# EAGLE design Smart Extruder Board (EAGLE 7.5.0)
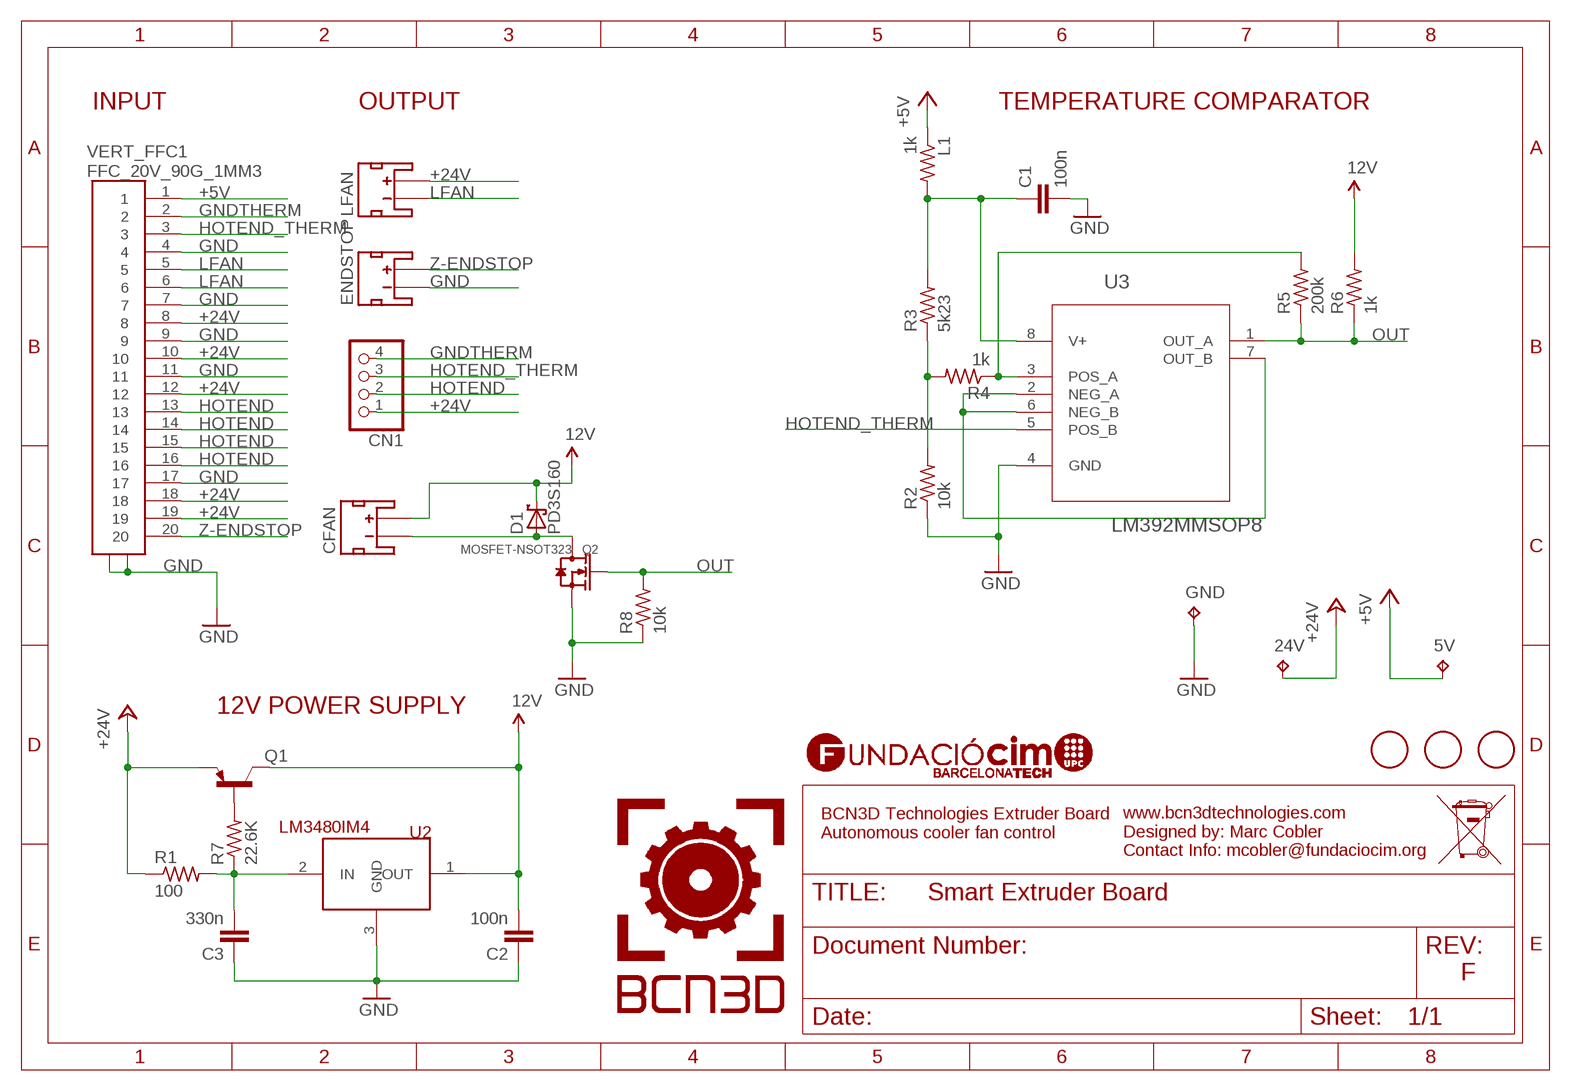
[diagram p0: schematic, sheet 1]

## Parts
5V  TPB1,27  [B1,27]
24V  TPB1,27  [B1,27]
C1  100n  C-EUC0603K  [C0603K]
C2  100n  C-EUC0603K  [C0603K]
C3  330n  C-EUC0805  [C0805]
CFAN  JST_2MM_MALE  [JST-2-SMD]
CN1  JST_4PINPA  [JST_PA_04]
D1  PD3S160  [POWERDI323]
ENDSTOP  JST_2MM_MALE  [JST-2-SMD]
GND  TPB1,27  [B1,27]
L1  1k  R-US_R0603  [R0603]
LFAN  JST_2MM_MALE  [JST-2-SMD]
Q1  BC807W  [SOT323-BEC]
Q2  MOSFET-NSOT323  [SOT323]
R1  100  R-US_R1210  [R1210]
R2  10k  R-US_R0603  [R0603]
R3  5k23  R-US_R0603  [R0603]
R4  1k  R-US_R0603  [R0603]
R5  200k  R-US_R0603  [R0603]
R6  1k  R-US_R0603  [R0603]
R7  22.6K  R-US_R0603  [R0603]
R8  10k  R-US_R0603  [R0603]
U2  LM3480IM4  [SOT23-3]
U3  LM392MMSOP8  [MSOP8]
U$1  FIDUCIAL  [FIDUCIAL_1MM]
U$2  FIDUCIAL  [FIDUCIAL_1MM]
U$3  FIDUCIAL  [FIDUCIAL_1MM]
VERT_FFC1  FFC_20V_90G_1MM3  [FCI_20WAY_1MM_3ST]

## Nets
12V: C2.2 CFAN.2(+) D1.C Q1.3(C) R6.2 U2.1(OUT)
+5V: 5V.TP L1.1 VERT_FFC1.1
+24V: 24V.TP CN1.1 LFAN.2(+) Q1.2(E) R1.1 VERT_FFC1.8 VERT_FFC1.10 VERT_FFC1.12 VERT_FFC1.18 VERT_FFC1.19
DRAIN: CFAN.1(-) D1.A Q2.3(D)
GND: C1.2 C2.1 C3.1 ENDSTOP.1(-) GND.TP Q2.2(S) R2.1 R8.1 U2.3(GND) U3.4(GND) VERT_FFC1.4 VERT_FFC1.7 VERT_FFC1.9 VERT_FFC1.11 VERT_FFC1.17 VERT_FFC1.GND1(GND) VERT_FFC1.GND2(GND)
GNDTHERM: CN1.4 VERT_FFC1.2
HOTEND: CN1.2 VERT_FFC1.13 VERT_FFC1.14 VERT_FFC1.15 VERT_FFC1.16
HOTEND_THERM: CN1.3 U3.5(POS_B) VERT_FFC1.3
IN: C3.2 R1.2 R7.1 U2.2(IN)
LFAN: LFAN.1(-) VERT_FFC1.5 VERT_FFC1.6
N$1: Q1.1(B) R7.2
N$2: C1.1 L1.2 R3.2 U3.8(V+)
N$3: U3.2(NEG_A) U3.6(NEG_B) U3.7(OUT_B)
N$4: R2.2 R3.1 R4.2
N$5: R4.1 R5.2 U3.3(POS_A)
OUT: Q2.1(G) R5.1 R6.1 R8.2 U3.1(OUT_A)
Z-ENDSTOP: ENDSTOP.2(+) VERT_FFC1.20
Unconnected: CFAN.NC1(PAD1) CFAN.NC2(PAD2) ENDSTOP.NC1(PAD1) ENDSTOP.NC2(PAD2) LFAN.NC1(PAD1) LFAN.NC2(PAD2)

## Notes on the sheet
- INPUT | OUTPUT | TEMPERATURE COMPARATOR
- 12V POWER SUPPLY
- BCN3D Technologies Extruder Board
  Autonomous cooler fan control
- www.bcn3dtechnologies.com
  Designed by: Marc Cobler
  Contact Info: mcobler@fundaciocim.org
- F

## Library data of the parts
5V 24V GND = testpad:TP: Test pad; OC_FARNELL: unknown
C1 C2 = rcl:C-EU: CAPACITOR, European symbol; MF: AVX; MPN: 06035C104KAT2A; OC_FARNELL: 1301804
C3 = rcl:C-EU: CAPACITOR, European symbol; MF: MURATA; MPN: GRM219R71H334KA88D; OC_FARNELL: 1828951
CFAN ENDSTOP LFAN = SparkFun-Connectors:JST_2MM_MALE: Mates to single-cell LiPo batteries. CONN-11443 Now with smashable polarity marks!; BTM_NEG: -; BTM_POS: +; MF: JST (JAPAN SOLDERLESS TERMINALS); MPN: S2B-PH-SM4-TB(LF)(SN); OC_FARNELL: 9492615; PROD_ID: CONN-11443; TOP_NEG: -; TOP_POS: +
CN1 = MarcEagleParts:JST_4PIN; MF: JST (JAPAN SOLDERLESS TERMINALS); MPN: SM04B-PASS-TBT(LF)(SN); OC_FARNELL: 2399347
D1 = diode:PD3S160: 1.0A SURFACE MOUNT SCHOTTKY BARRIER RECTIFIER POWERDI ® 323 Source: http://www.diodes.com/datasheets/ds30899.pdf; MF: DIODES INC.; MPN: PD3S160-7; OC_FARNELL: 1843697
L1 R4 R6 = rcl:R-US_: RESISTOR, American symbol; MF: MULTICOMP; MPN: MCMR06X1001FTL; OC_FARNELL: 2073348
Q1 = transistor-pnp:BC807*: PNP Transistror; MF: NXP; MPN: BC807W,115; OC_FARNELL: 2439010
Q2 = MarcEagleParts:MOSFET-N: CJ2302：SMD MOSFET N-CH 20V-2.1A; MF: NXP; MPN: PMF370XN,115; OC_FARNELL: 1758096
R1 R7 = rcl:R-US_: RESISTOR, American symbol; MF: MULTICOMP; MPN: MC0603SAF330JT5E; OC_FARNELL: 1632431
R2 R8 = rcl:R-US_: RESISTOR, American symbol; MF: MULTICOMP; MPN: MCMR06X1002FTL; OC_FARNELL: 2073349
R3 = rcl:R-US_: RESISTOR, American symbol; MF: PANASONIC ELECTRONIC COMPONENTS; MPN: ERJ3EKF5231V; OC_FARNELL: 2059380
R5 = rcl:R-US_: RESISTOR, American symbol; MF: PANASONIC ELECTRONIC COMPONENTS; MPN: ERJ3EKF2003V; OC_FARNELL: 2059509
U2 = SparkFun-PowerIC:LM3480IM4: Small package linear regulator; MF: TEXAS INSTRUMENTS; MPN: LM3480IM3-12/NOPB; OC_FARNELL: 1469099
U3 = MarcEagleParts:LM392M: Low Power Operational Amplifier; OC_FARNELL: unknown
U$1-U$3 = adafruit:FIDUCIAL: For use by pick and place machines to calibrate the vision/machine, 1mm By microbuilder.eu; OC_FARNELL: unknown
VERT_FFC1 = MarcEagleParts:FFC_20V_90G_1MM; OC_FARNELL: unknown

## Net classes
0 default: width 0.305 mm, drill 0.254 mm, clearance 0.254 mm

## Board
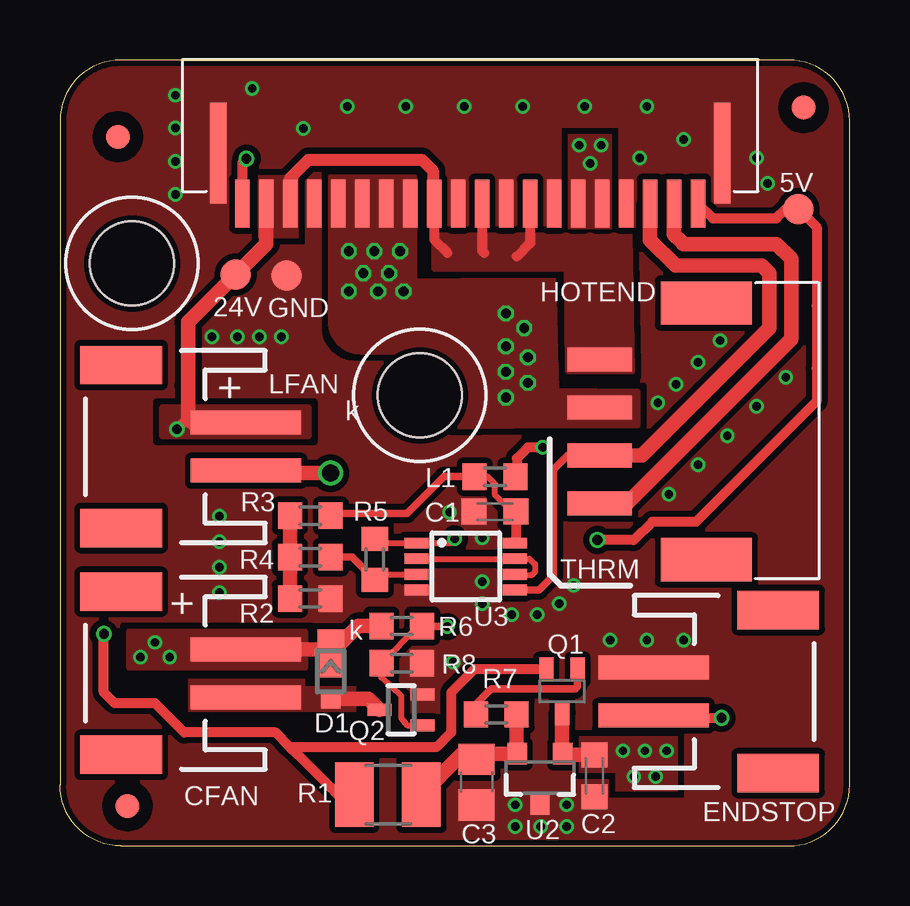
[diagram p1: board, top side]
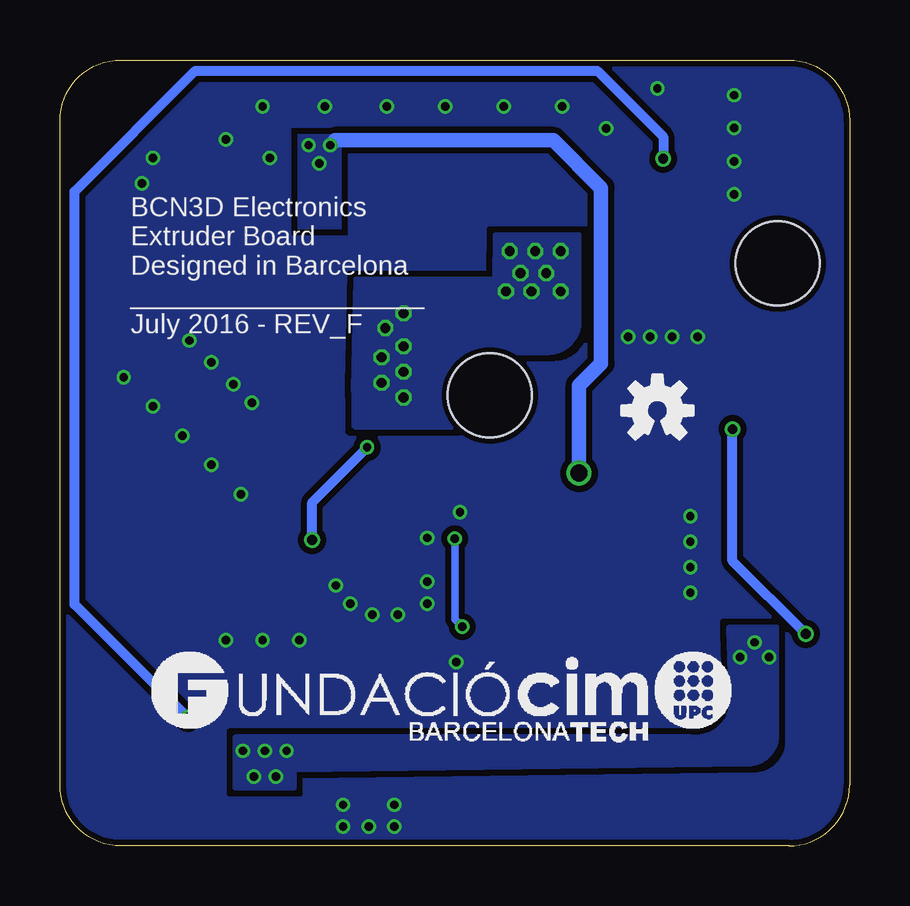
[diagram p2: board, bottom side, seen from below]

Size 32.92 x 32.77 mm. Coordinates in mm from the lower left corner, seen from the top.
Outline: 2.54,0 30.38,0 arc90 32.92,2.54 32.92,30.23 arc90 30.38,32.77 2.54,32.77 arc90 0,30.23 0,2.54 arc90 2.54,0
Copper layers (1*16): Top 0.018mm / dielectric 1.55mm / Bottom 0.018mm
Design rules "eC_2Layer_PClass6_BaseCopperO18_eCDefault": minimum track width 0.15mm, minimum drill 0.35mm, track to track 0.15mm, track to pad 0.15mm, pad to pad 0.15mm, via to via 0.15mm, smd to smd 0mil, copper to edge 0.25mm, drill to drill 0.35mm, minimum pad ring 0.175mm, minimum via ring 0.125mm, stop-mask expansion 0mil, vias tented up to drill 0.45mm, thermal gap 0.2mm
Holes 3.5 mm at 3,24.28 15,18.78

### Footprints (pad centres in the part's own frame; a part is rotated, then mirrored left to right if it is on the bottom)
B1,27 = smd 1.27 x 1.27: TP 0,0
C0603K = smd 1.05 x 1.08: 1 -0.875,0; 2 0.875,0
C0805 = smd 1.3 x 1.5: 1 -0.95,0; 2 0.95,0
JST-2-SMD = smd 1 x 4.6: 1 -1,-3.7; 2 1,-3.7 | smd 1.6 x 3.4: NC1 -3.4,1.5; NC2 3.4,1.5
JST_PA_04 = smd 1 x 2.7: 1 -3,-2.5; 2 -1,-2.5; 3 1,-2.5; 4 3,-2.5 | smd 1.8 x 3.8: NC1 -5.35,1.95; NC2 5.35,1.95
POWERDI323 = smd 0.8 x 0.8: A 1.15,0 | smd 2 x 1.1: C -0.75,0
R0603 = smd 1 x 1.1: 1 -0.85,0; 2 0.85,0
SOT323-BEC = smd 0.6 x 1: 1 -0.65,-0.9; 2 0.65,-0.9; 3 0,0.9
SOT323 = smd 0.5 x 1: 1 -0.65,-0.9; 2 0.65,-0.9; 3 0,0.9
R1210 = smd 1.6 x 2.7: 1 -1.4,0; 2 1.4,0
SOT23-3 = smd 0.8 x 0.9: 1 -0.95,-1; 2 0.95,-1; 3 0,1.1
MSOP8 = smd 0.45 x 1: 1 -0.975,-2.05; 2 -0.325,-2.05; 3 0.325,-2.05; 4 0.975,-2.05; 5 0.975,2.05; 6 0.325,2.05; 7 -0.325,2.05; 8 -0.975,2.05
FIDUCIAL_1MM = smd 1 x 1: 1 0,0
FCI_20WAY_1MM_3ST = smd 0.6 x 2: 1 -9.5,2.5; 2 -8.5,2.5; 3 -7.5,2.5; 4 -6.5,2.5; 5 -5.5,2.5; 6 -4.5,2.5; 7 -3.5,2.5; 8 -2.5,2.5; 9 -1.5,2.5; 10 -0.5,2.5; 11 0.5,2.5; 12 1.5,2.5; 13 2.5,2.5; 14 3.5,2.5; 15 4.5,2.5; 16 5.5,2.5; 17 6.5,2.5; 18 7.5,2.5; 19 8.5,2.5; 20 9.5,2.5 | smd 0.7 x 4.2: GND1 -10.5,0.4; GND2 10.5,0.4

### Placement (x,y rotation side)
5V  30.78,26.56 270 top
24V  7.32,23.81 0 top
C1  18.14,13.94 180 top
C2  22.28,2.92 90 top
C3  17.37,2.66 90 top
CFAN  4.05,7.2 90 top
CN1  25,17.28 270 top
D1  11.29,7.28 270 top
ENDSTOP  28.44,6.44 270 top
GND  9.45,23.77 0 top
L1  18.14,15.39 180 top
LFAN  4.05,16.65 90 top
Q1  20.93,6.46 180 top
Q2  14.22,5.68 90 top
R1  13.67,2.14 0 top
R2  10.44,10.31 180 top
R3  10.44,13.76 0 top
R4  10.44,12.04 180 top
R5  13.12,11.94 270 top
R6  14.25,9.16 180 top
R7  18.19,5.48 180 top
R8  14.25,7.62 180 top
U2  20.01,2.84 180 top
U3  16.92,11.65 270 top
U$1  31,30.78 0 top
U$2  2.82,1.67 0 top
U$3  2.41,29.57 0 top
U$5  [OSHW-LOGO-S]  8.01,18.15 0 bottom
U$6  [FCIM_LOGO]  30.94,0.72 0 bottom
VERT_FFC1  17.1,29.28 180 top

### Tracks (layer width: path | path; a pad name or v marks a point on that pad's centre or on a via)
12V  (via drill 0.35)
  Top 0.61: C2.2 21.01,3.79 U2.1 20.93,3.87 Q1.3 | R6.2 12.43,9.16 D1.C 11.27,8.2 8.41,8.2 8.38,8.23 7.78,8.23 CFAN.2
  other vias: 3.35,7.88 4.57,7.88 23.47,3.96 25.3,3.96 24.38,3.96 24.84,2.9 23.93,2.9 3.96,8.49
  pour Bottom (no thermals): 5.03,9.1 4.92,5.84 arc92 6.65,4.52 25.6,4.52 25.6,2.44 23.16,2.44 23.16,3.2 4.15,3.44 arc-89 3.05,4.71 3.05,9.1
  pour Top (no thermals): 10.21,8.94 10.21,7.42 2.9,7.42 2.9,8.94
  pour Top (no thermals): 21.64,4.57 25.76,4.57 25.76,2.29 23.16,2.29 23.16,3.05 21.64,3.05
+5V  (via drill 0.35, 0.41)
  Top 0.406: VERT_FFC1.1 27.22,26.16 29.87,26.16 30.26,26.55 5V.TP 31.55,25.79 31.55,22.51 31.55,19.92 31.55,18.54 26.98,13.97 26.52,13.52 25.15,13.52 24.69,13.52 23.93,12.75 v22.4,12.75 | v20.12,16.61 19.51,16.61 19.05,16.15 19.05,15.46 L1.1
  Bottom 0.406: v22.4,12.75 22.4,14.33 v20.12,16.61
+24V  (via drill 0.41)
  Top 0.406: VERT_FFC1.12 15.6,25.28 16.15,24.73 | VERT_FFC1.10 17.6,24.8 17.68,24.73 | VERT_FFC1.8 19.6,25.12 19.05,24.57 | Q1.2 17.26,7.36 16.31,6.4 16.31,4.72 15.7,4.11 9.6,4.11 | 12.8,2.21 R1.1 11.58,2.14 11.28,2.44 9.91,3.81 9.6,4.11 | 9.6,4.11 8.99,4.72 5.18,4.72 3.96,5.94 2.29,5.94 1.83,6.4 v1.83,8.84 | v4.88,17.37 5.33,17.83
  Top 0.508: VERT_FFC1.18 9.6,27.84 10.36,28.6 15.09,28.6 15.54,28.15 15.54,26.84 VERT_FFC1.12
  Top 0.61: VERT_FFC1.19 8.6,25.1 24V.TP 5.33,21.83 5.33,19.2 5.33,17.83 5.52,17.65 7.01,17.65 | 6.43,17.65 7.01,17.65 | 7.01,17.65 LFAN.2
  Bottom 0.406: v1.83,8.84 4.88,11.89 v4.88,17.37
  pour Top (no thermals): 23.86,19.74 21.16,19.76 21.11,24.03 15.6,24.03 15.6,25.49 23.77,25.49
  pour Top (no thermals): 8.26,25.34 8.26,27.96 9.96,27.96 9.96,25.34
  pour Top (no thermals): 4.27,18.29 10.36,18.29 10.36,17.07 4.27,17.07
DRAIN
  Top 0.61: Q2.3 12.87,6.13 D1.A
  pour Top (no thermals): 5.33,6.96 10.21,6.96 10.21,6.66 12.34,6.66 12.34,5.59 5.33,5.59
GND  (via drill 0.35)
  other vias: 4.81,31.3 4.81,29.93 29.04,28.69 29.5,27.62 19.29,30.82 16.85,30.82 14.41,30.82 11.97,30.82 10.14,29.91 4.81,28.54 21.88,30.82 24.47,30.82 24.93,18.48 25.69,19.24 26.6,20.15 27.52,21.07 25.38,14.67 26.6,15.89 27.82,17.11 29.04,18.33 30.26,19.54 4.81,27.16 18.98,1.71 18.98,0.8 21.12,1.71 21.12,0.8 20.05,0.8 8.01,31.58 17.61,10.1 16.39,7.66 16.24,13.91 6.33,21.22 7.4,21.22 8.32,21.22 18.83,9.64 19.9,9.64 20.81,10.1 21.42,10.86 25.99,29.45 24.16,28.69 22.95,8.57 24.47,8.57 25.99,8.57 6.64,13.75 6.64,12.69 6.64,11.62 6.64,10.55 17.61,11.01 17.61,12.84 9.23,21.22
  pour Top (rank 6, no thermals): 0,2.47 0,30.27 arc-90 2.53,32.81 30.41,32.95 arc-90 32.97,30.4 32.92,2.47 arc-90 30.38,-0.07 2.54,-0.07 arc-90
  pour Bottom (rank 6, no thermals): 0.01,2.49 0.14,30.29 arc-89 2.67,32.82 30.56,32.94 arc-91 33.11,30.39 32.98,2.46 arc-90 30.44,-0.07 2.55,-0.07 arc-90
GNDTHERM
  Top 0.61: CN1.4 23.01,14.28 23.62,14.28 30.48,21.14 30.48,24.49 29.87,25.1 25.99,25.1 25.91,25.18 25.6,25.49 VERT_FFC1.2
HOTEND  (via drill 0.41)
  other vias: 12.04,24.79 13.11,24.79 14.17,24.79 12.65,23.88 13.72,23.88 12.04,23.12 13.26,23.12 14.33,23.12 18.59,18.7 18.59,19.76 18.59,20.83 19.51,19.31 19.51,20.37 19.35,21.59 18.59,22.2
  pour Top (rank 2, no thermals): 14.78,27.91 14.78,23.57 20.57,23.62 20.71,19 24.08,18.97 24.08,17.5 20.61,17.5 17.26,17.46 14.02,17.46 14.02,20.57 12.55,20.57 arc-90 11.28,21.84 11.28,27.91
  pour Bottom (rank 2, no thermals): 14.78,25.47 14.81,23.6 20.6,23.62 20.71,19 20.68,19 20.68,17.53 20.61,17.5 20.61,17.46 14.02,17.46 14.02,20.57 12.55,20.57 arc-90 11.28,21.84 11.28,25.47
HOTEND_THERM
  Top 0.305: CN1.3 21.16,16.28 20.57,15.7 20.57,11.28 19.96,10.67 U3.5
  Top 0.61: VERT_FFC1.3 24.6,26.06 24.6,25.25 25.67,24.18 29.26,24.18 29.57,23.88 29.57,21.59 24.25,16.28 24.08,16.28 CN1.3
IN
  Top 0.61: R7.1 19.04,3.86 U2.2 17.61,3.84 C3.2 17.23,3.84 16.77,3.84 R1.2
LFAN  (via drill 0.35, 0.7)
  Top 0.61: LFAN.1 7.86,15.54 v11.28,15.54
  Bottom 0.61: v21.64,29.21 21.44,29.41 12.34,29.41 10.36,27.43 10.36,20.12 11.28,19.2 v11.28,15.54
  other vias: 22.1,28.45 22.56,29.21
  pour Top (no thermals): 23.01,25.71 23.01,29.67 21.18,29.67 21.18,25.71
  pour Bottom (no thermals): 21.18,25.71 21.18,29.67 23.01,29.67 23.01,25.71
N$1
  Top 0.305: R7.2 17.34,5.91 17.83,6.4 17.98,6.55 21.49,6.55 21.58,6.65 Q1.1
N$2
  Top 0.254: L1.2 16.92,15.39 | 11.49,13.56 R3.2 | L1.2 17.55,15.39 | C1.1 18.83,13.93 18.14,14.63 18.14,15.09 17.83,15.39 L1.2
  Top 0.305: 16.92,15.39 16,15.39 14.48,13.87 11.39,13.87 R3.2
  Top 0.406: C1.1 19.01,12.67 U3.8
N$3
  Top 0.254: U3.2 U3.7 19.57,11.97 19.81,11.73 19.81,11.43 19.66,11.28 19.01,11.28 | 19.01,11.28 U3.6 19.01,11.28
N$4
  Top 0.61: R2.2 R4.2 R3.1
N$5
  Top 0.254: 12.99,11.09 R5.2 13.36,11.32 U3.3
  Top 0.305: R4.1 12.18,12.04 R5.2
OUT  (via drill 0.35)
  Top 0.254: R5.1 13.29,12.62 U3.1 16.28,12.62 v16.46,12.8 | 14.92,9.14 R8.2 13.4,7.02 14.22,6.25 14.22,5.33 14.48,5.03 Q2.1
  Top 0.305: v16.15,9.14 15.12,9.14 | 15.12,9.14 R6.1 | 15.12,9.14 14.92,9.14 | Q2.1
  Bottom 0.305: v16.46,12.8 16.46,9.45 v16.15,9.14
Z-ENDSTOP  (via drill 0.41)
  Top 0.406: ENDSTOP.2 24.84,5.33 v27.58,5.33 | v7.77,28.65 7.6,28.48 VERT_FFC1.20
  Bottom 0.406: v27.58,5.33 32.31,10.06 32.31,27.28 27.28,32.31 10.52,32.31 7.77,29.57 v7.77,28.65

### Text on the board
tPlace: HOTEND | + | k | THRM | + | k
bPlace: BCN3D Electronics / Extruder Board / Designed in Barcelona / ___________________ / July 2016 - REV_F
DrillLegend_01-16: 01-16